# EAGLE schematic questao4 (EAGLE 9.6.2)
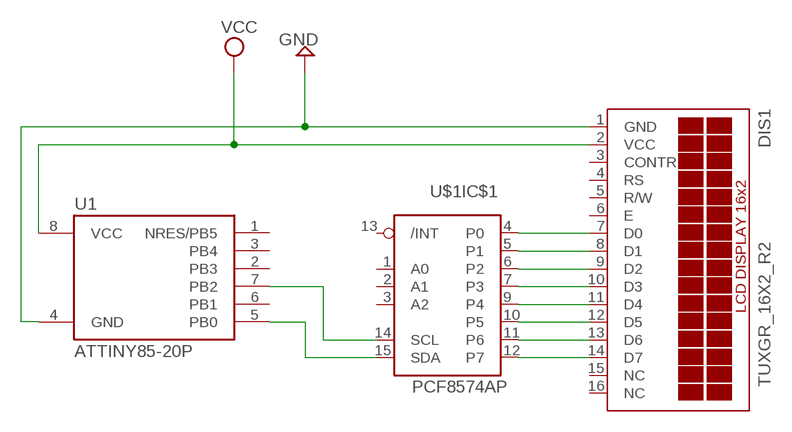
[diagram p0: schematic, sheet 1]

## Parts
DIS1  TUXGR_16X2_R2  [TUXGR_16X2_R2]
U1  ATTINY85-20P  [PDIP08_300MIL]
U$1  PCF8574AP  [DIL16]

## Nets
GND: DIS1.1(GND) U1.4(GND)
N$3: DIS1.7(D0) U$1.4(IC$1:P0)
N$4: DIS1.8(D1) U$1.5(IC$1:P1)
N$5: DIS1.9(D2) U$1.6(IC$1:P2)
N$6: DIS1.10(D3) U$1.7(IC$1:P3)
N$7: DIS1.11(D4) U$1.9(IC$1:P4)
N$8: DIS1.12(D5) U$1.10(IC$1:P5)
N$9: DIS1.13(D6) U$1.11(IC$1:P6)
N$10: DIS1.14(D7) U$1.12(IC$1:P7)
N$11: U1.7(PB2) U$1.14(IC$1:SCL)
N$12: U1.5(PB0) U$1.15(IC$1:SDA)
VCC: DIS1.2(VCC) U1.8(VCC)
Unconnected: DIS1.3(CONTR) DIS1.4(RS) DIS1.5(R/W) DIS1.6(E) DIS1.15(NC) DIS1.16(NC) U1.1(NRES/PB5) U1.2(PB3) U1.3(PB4) U1.6(PB1) U$1.1(IC$1:A0) U$1.2(IC$1:A1) U$1.3(IC$1:A2) U$1.13(IC$1:/INT)

## Power pins joined to a net without a drawn wire
GND: U$1.8(PWR:GND)
VCC: U$1.16(PWR:VCC)

## Library data of the parts
DIS1 = display-lcd:TUXGR_16X2_R2: Tuxgraphics LCD display 16x2 characters reflective, without background light Source: tuxgr_12x2_r2.pdf; OC_FARNELL: unknown; OC_NEWARK: unknown
U1 = _hhn_attiny25_45_85:ATTINY85*: ATMEL ATtiny 85 Packages: P = PDIP 08 30mil S = SOIC 08 EIAJ 208mil Technologies Note: for complete ordering code (temp. range, finish, tape&reel etc.) see www.atmel.com • Supply Voltage: V = (1.8…5.5)V | [blank] = (2.7…5.5)V • Speed: 10 = 10 MHz | 20 = 20 MHz Author: Dipl.-Ing. FH Rainer Bayer HHN Hochschule Heilbronn (Heilbronn University), rainer.bayer@hs-heilbronn.de Ingenieurbüro ing-rb, mail@ing-rb.de
U$1 = i2c:PCF8574: Remote 8-Bit I/O Expander for I²C Bus